# EAGLE design SerialMux-v10 (EAGLE 5.07)
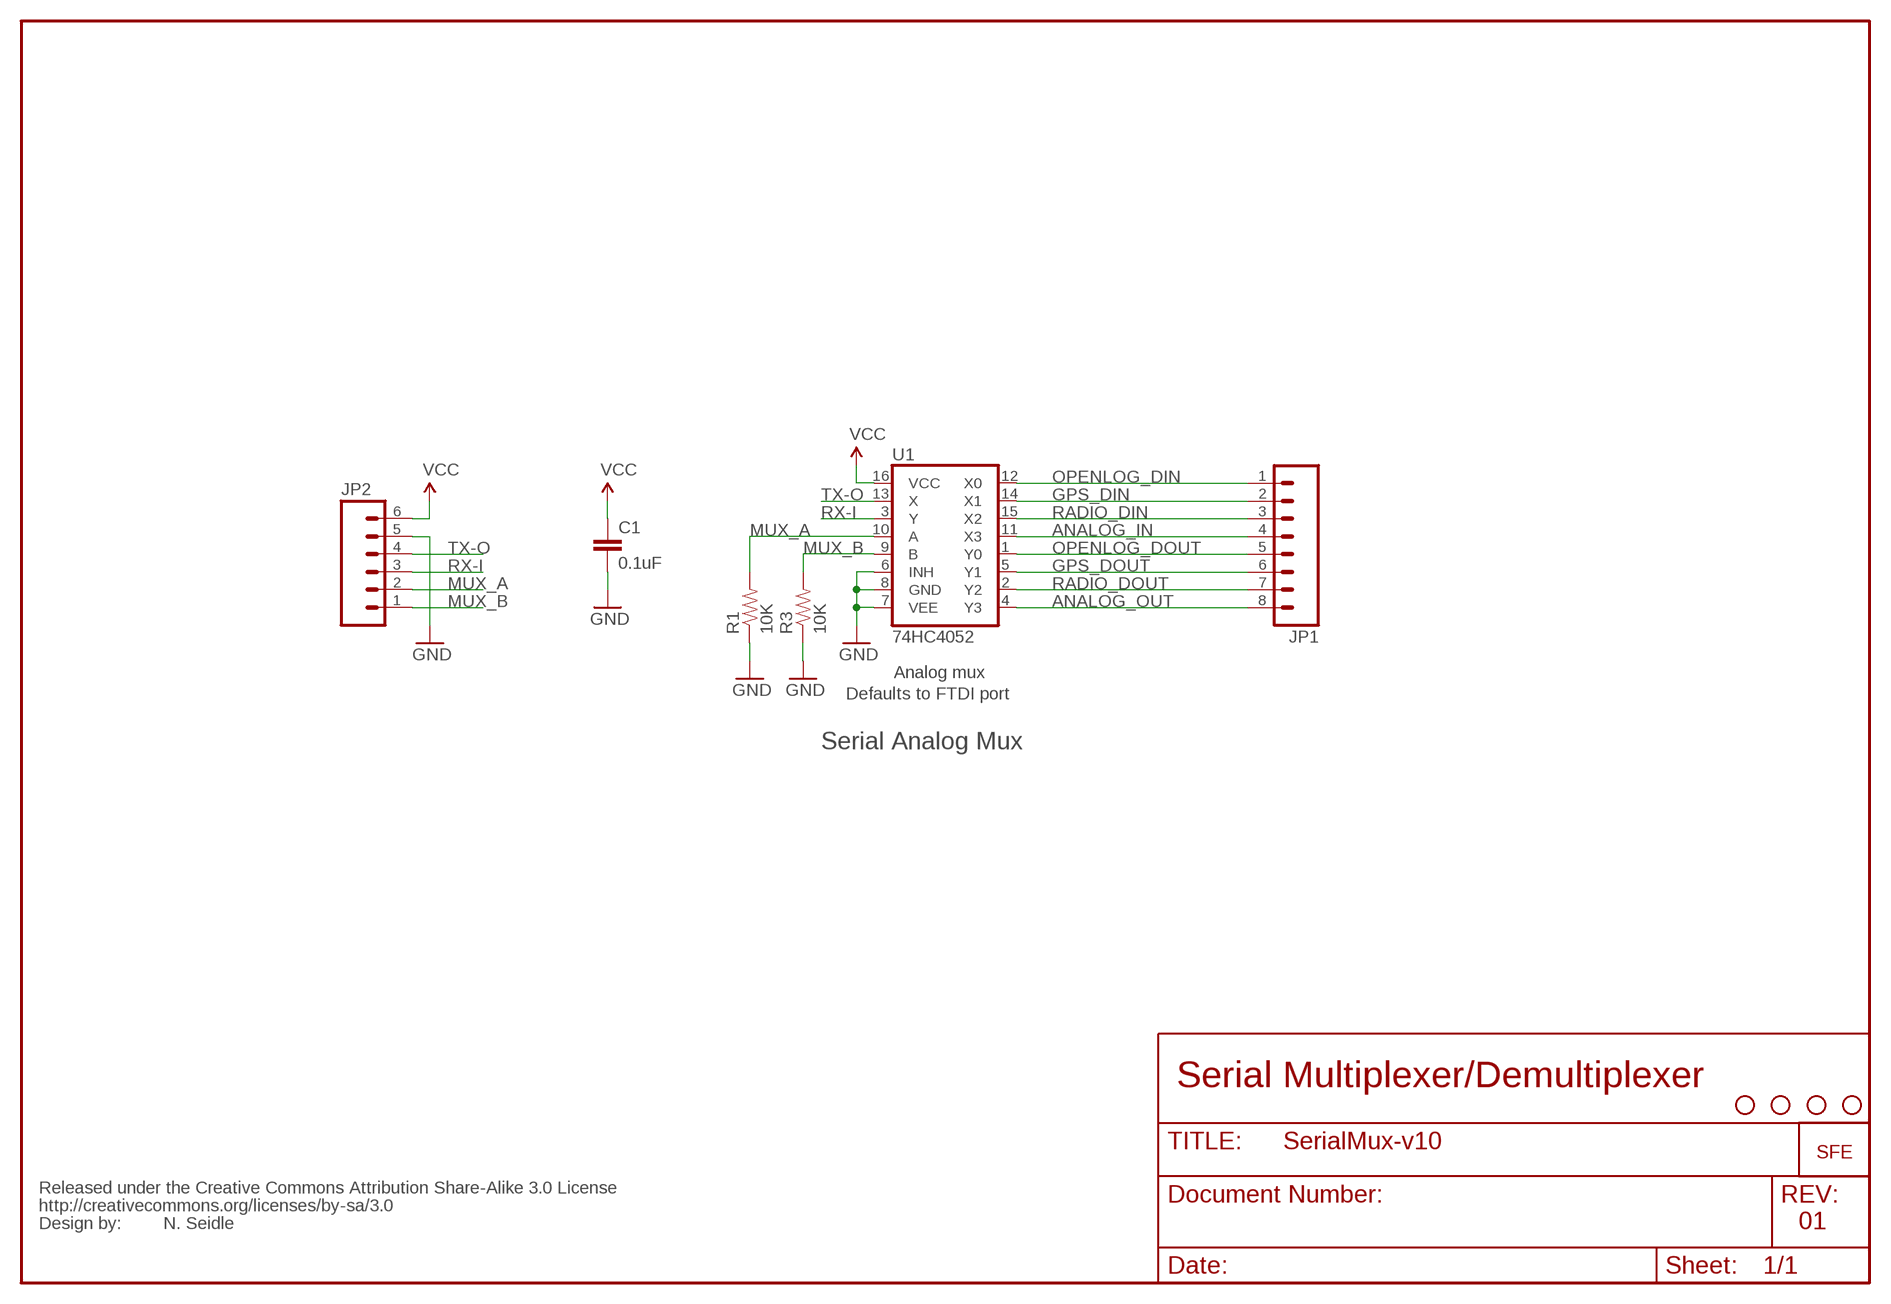
[diagram p0: schematic, sheet 1]

## Parts
C1  0.1uF  CAPPTH2  [CAP-PTH-SMALL2]
JP1  M08  [1X08]
JP2  M06SIP  [1X06]
R1  10K  RESISTORPTH1  [AXIAL-0.3]
R3  10K  RESISTORPTH1  [AXIAL-0.3]
U1  74HC4052  74HC4052DIP  [DIL16]
U$1  LOGO-SFENEW  [SFE-NEW-WEBLOGO]
U$2  STAND-OFF  [STAND-OFF]
U$3  STAND-OFF  [STAND-OFF]
U$4  STAND-OFF  [STAND-OFF]
U$5  STAND-OFF  [STAND-OFF]
U$6  CREATIVE_COMMONS  [CREATIVE_COMMONS]

## Nets
ANALOG_IN: JP1.4 U1.11(X3)
ANALOG_OUT: JP1.8 U1.4(Y3)
GND: C1.2 JP2.5 R1.P$1 R3.P$1 U1.6(INH) U1.7(VEE) U1.8(GND)
GPS_DIN: JP1.2 U1.14(X1)
GPS_DOUT: JP1.6 U1.5(Y1)
MUX_A: JP2.2 R1.P$2 U1.10(A)
MUX_B: JP2.1 R3.P$2 U1.9(B)
OPENLOG_DIN: JP1.1 U1.12(X0)
OPENLOG_DOUT: JP1.5 U1.1(Y0)
RADIO_DIN: JP1.3 U1.15(X2)
RADIO_DOUT: JP1.7 U1.2(Y2)
RX-I: JP2.3 U1.3(Y)
TX-O: JP2.4 U1.13(X)
VCC: C1.1 JP2.6 U1.16(VCC)

## Notes on the sheet
- Analog mux
- Defaults to FTDI port
- Serial Analog Mux
- Serial Multiplexer/Demultiplexer
- N. Seidle | 01

## Library data of the parts
C1 = SparkFun:CAP: Capacitor Standard 0603 ceramic capacitor, and 0.1" leaded capacitor.
JP1 = SparkFun:M08: Header 8 Standard 8-pin 0.1" header. Use with straight break away headers (SKU : PRT-00116), right angle break away headers (PRT-00553), swiss pins (PRT-00743), machine pins (PRT-00117), and female headers (PRT-00115).
JP2 = SparkFun:M06: Header 6 Standard 6-pin 0.1" header. Use with straight break away headers (SKU : PRT-00116), right angle break away headers (PRT-00553), swiss pins (PRT-00743), machine pins (PRT-00117), and female headers (PRT-00115). Molex polarized connector foot print use with SKU : PRT-08094 with associated crimp pins and housings. NOTES ON THE VARIANTS LOCK and LOCK_LONGPADS... This footprint was designed to help hold the alignment of a through-hole component (i.e. 6-pin header) while soldering it into place. You may notice that each hole has been shifted either up or down by 0.005 of an inch from it's more standard position (which is a perfectly straight line). This slight alteration caused the pins (the squares in the middle) to touch the edges of the holes. Because they are alternating, it causes a "brace" to hold the component in place. 0.005 has proven to be the perfect amount of "off-center" position when using our standard breakaway headers. Although looks a little odd when you look at the bare footprint, once you have a header in there, the alteration is very hard to notice. Also, if you push a header all the way into place, it is covered up entirely on the bottom side. This idea of altering the position of holes to aid alignment will be further integrated into the Sparkfun Library for other footprints. It can help hold any component with 3 or more connection pins.
R1 R3 = SparkFun:RESISTOR: Resistor Basic schematic elements and footprints for 0603, 1206, and PTH 1/10th watt (small) resistors.
U1 = SparkFun:74HC4052
U$1 = SparkFun:LOGO-SFE: Spark Fun Electronics PCB Logo This is the standard Spark Fun Electronics PCB logo.
U$2-U$5 = SparkFun:STAND-OFF: Stand Off This is the mechanical footprint for a #4 phillips button head screw. Use the keepout ring to avoid running the screw head into surrounding components. SKU : PRT-00447
U$6 = SparkFun:CREATIVE_COMMONS

## Net classes
1 vcc: width 0.635 mm

## Board
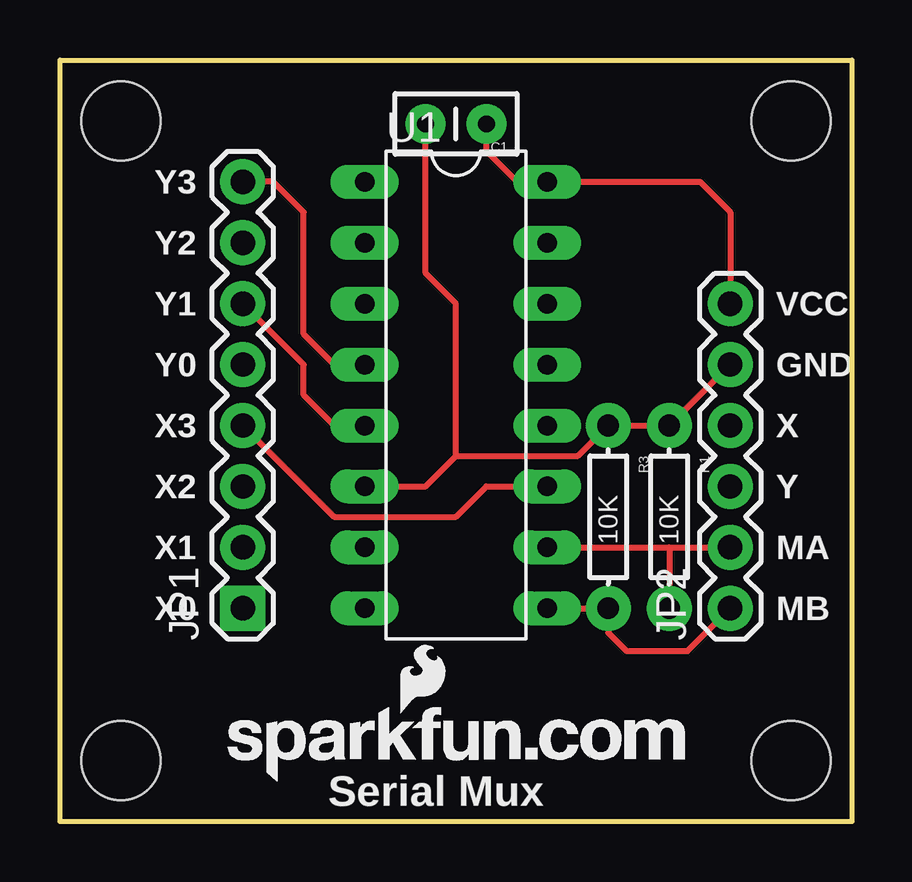
[diagram p1: board, top side]
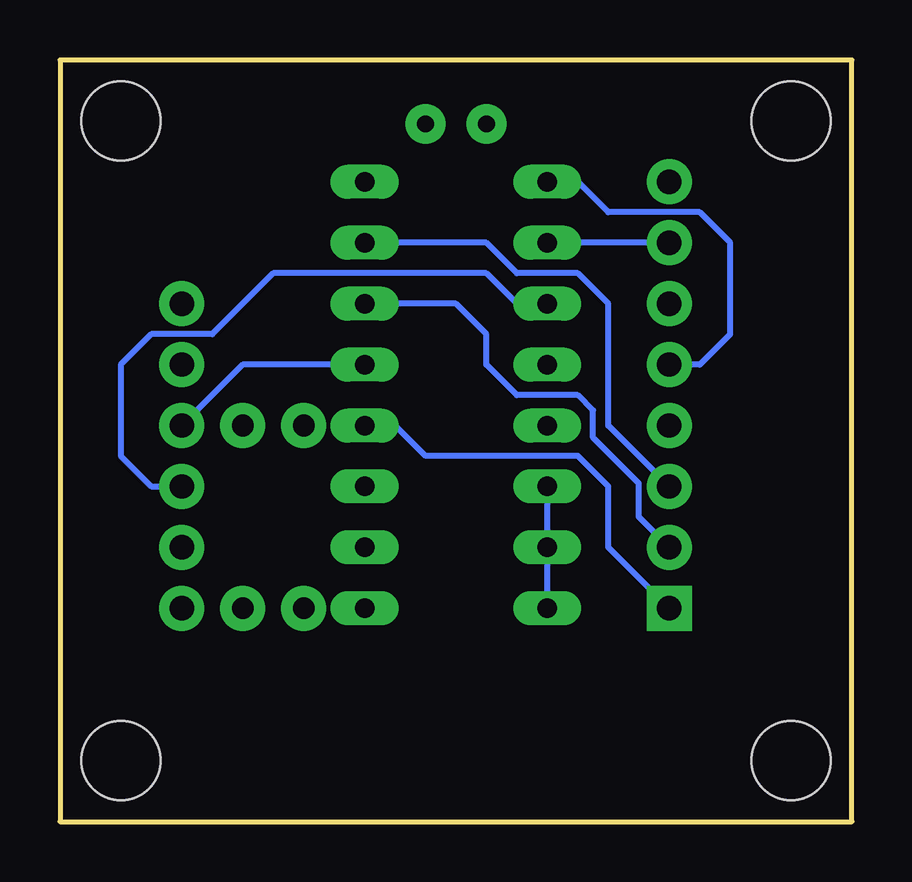
[diagram p2: board, bottom side, seen from below]

Size 33.02 x 31.75 mm. Coordinates in mm from the lower left corner, seen from the top.
Outline: 0,31.75 33.02,31.75 33.02,0 0,0 0,31.75
Copper layers (1*16): Top 0.035mm / dielectric 1.5mm / Bottom 0.035mm
Design rules "SparkFun": minimum track width 8mil, minimum drill 20mil, track to track 8mil, track to pad 8mil, pad to pad 8mil, via to via 8mil, smd to smd 8mil, copper to edge 10mil, drill to drill 8mil, minimum pad ring 12mil, minimum via ring 10mil, stop-mask expansion 4mil, vias tented up to drill 20mil, thermal gap 10mil

### Footprints (pad centres in the part's own frame; a part is rotated, then mirrored left to right if it is on the bottom)
CAP-PTH-SMALL2 = drill 0.7 pad 1.651 round: 1 0,0; 2 2.54,0
1X08 = drill 1.016 pad 1.88 square: 1 0,0 | drill 1.016 pad 1.88 round: 2 2.54,0; 3 5.08,0; 4 7.62,0; 5 10.16,0; 6 12.7,0; 7 15.24,0; 8 17.78,0
1X06 = drill 1.016 pad 1.88 round: 1 0,0; 2 2.54,0; 3 5.08,0; 4 7.62,0; 5 10.16,0; 6 12.7,0
AXIAL-0.3 = drill 0.9 pad 1.88 round: P$1 -3.81,0; P$2 3.81,0
DIL16 = drill 0.813 long: 1 -8.89,-3.81; 2 -6.35,-3.81; 3 -3.81,-3.81; 4 -1.27,-3.81; 5 1.27,-3.81; 6 3.81,-3.81; 7 6.35,-3.81; 8 8.89,-3.81; 9 8.89,3.81; 10 6.35,3.81; 11 3.81,3.81; 12 1.27,3.81; 13 -1.27,3.81; 14 -3.81,3.81; 15 -6.35,3.81; 16 -8.89,3.81
STAND-OFF = hole 3.302: 0,0

### Placement (x,y rotation side)
C1  17.78,29.08 180 top
JP1  7.62,8.89 90 top
JP2  27.94,8.89 90 top
R1  25.4,12.7 270 top
R3  22.86,12.7 270 top
U1  16.51,17.78 270 top
U$1  6.99,1.65 0 top
U$2  2.54,2.54 0 top
U$3  30.48,2.54 0 top
U$4  2.54,29.21 0 top
U$5  30.48,29.21 0 top
U$6  -6.35,-10.16 0 top  (outside the outline)

### Tracks (layer width: path | path; a pad name or v marks a point on that pad's centre or on a via)
ANALOG_IN
  Top 0.254: JP1.4 11.43,12.7 16.51,12.7 17.78,13.97 U1.11
ANALOG_OUT
  Top 0.254: JP1.8 8.89,26.67 10.16,25.4 10.16,20.32 11.43,19.05 U1.4
GND
  Top 0.254: U1.6 15.24,13.97 16.51,15.24 | 16.51,15.24 21.59,15.24 R3.P$1 R1.P$1 JP2.5 | C1.2 15.24,22.86 16.51,21.59 16.51,15.24
  Bottom 0.254: U1.8 U1.7 U1.6
GPS_DIN
  Bottom 0.254: U1.14 16.51,21.59 15.24,20.32 15.24,19.05 13.97,17.78 11.43,17.78 10.79,17.14 10.79,16 8.89,14.1 8.89,12.7 JP1.2
GPS_DOUT
  Top 0.254: JP1.6 10.16,19.05 10.16,17.78 11.43,16.51 U1.5
MUX_A
  Top 0.254: U1.10 25.4,11.43 | 25.4,11.43 JP2.2 | 25.4,11.43 R1.P$2
MUX_B
  Top 0.254: U1.9 R3.P$2 22.86,7.87 23.62,7.11 26.16,7.11 JP2.1
OPENLOG_DIN
  Bottom 0.254: U1.12 19.05,16.51 17.78,15.24 11.43,15.24 10.16,13.97 10.16,11.43 JP1.1
OPENLOG_DOUT
  Bottom 0.254: JP1.5 6.35,19.05 5.08,20.32 5.08,24.13 6.35,25.4 10.16,25.4 11.43,26.67 U1.1
RADIO_DIN
  Bottom 0.254: JP1.3 10.16,16.51 10.16,21.59 11.43,22.86 13.97,22.86 15.24,24.13 U1.15
RADIO_DOUT
  Bottom 0.254: JP1.7 U1.2
RX-I
  Bottom 0.254: U1.3 13.97,21.59 15.24,22.86 24.13,22.86 26.67,20.32 29.21,20.32 30.48,19.05 30.48,15.24 29.21,13.97 JP2.3
TX-O
  Bottom 0.254: U1.13 25.4,19.05 JP2.4
VCC
  Top 0.254: C1.1 17.78,27.94 19.05,26.67 U1.16 26.67,26.67 27.94,25.4 JP2.6

### Text on the board
Bottom: 4-27-10
tPlace: Y3 | Y2 | Y1 | VCC | Y0 | GND | X3 | X | X2 | Y | X1 | MA | X0 | MB | Serial Mux
tNames: N. Seidle
tValues: DNP